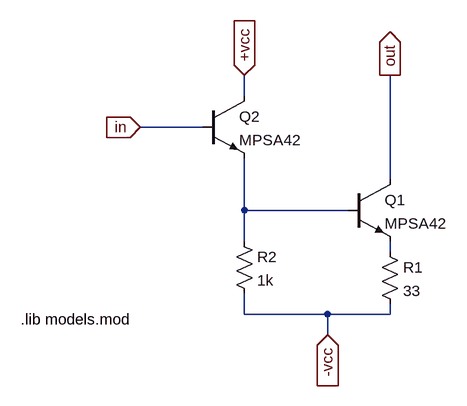
[diagram p0: schematic ss-vas-npn.asc]
ss-vas-npn.asc, the LTspice schematic file:
Version 4
SHEET 1 880 680
WIRE -272 -400 -272 -432
WIRE -336 -352 -432 -352
WIRE -48 -272 -48 -432
WIRE -272 -224 -272 -304
WIRE -112 -224 -272 -224
WIRE -272 -176 -272 -224
WIRE -48 -160 -48 -176
WIRE -272 -64 -272 -96
WIRE -144 -64 -272 -64
WIRE -48 -64 -48 -80
WIRE -48 -64 -144 -64
WIRE -144 -32 -144 -64
FLAG -432 -352 in
IOPIN -432 -352 In
FLAG -144 -32 -vcc
IOPIN -144 -32 In
FLAG -272 -432 +vcc
IOPIN -272 -432 In
FLAG -48 -432 out
IOPIN -48 -432 Out
DATAFLAG -272 -224 "round($*100)/100"
SYMBOL npn -112 -272 R0
SYMATTR InstName Q1
SYMATTR Value MPSA42
SYMBOL res -64 -176 R0
SYMATTR InstName R1
SYMATTR Value 33
SYMBOL npn -336 -400 R0
SYMATTR InstName Q2
SYMATTR Value MPSA42
SYMBOL res -288 -192 R0
SYMATTR InstName R2
SYMATTR Value 1k
TEXT -616 -56 Left 2 !.lib models.mod

The netlist it stands for:
* ss-vas-npn.asc
Q1 out N001 N002 0 MPSA42
R1 N002 -vcc 33
Q2 +vcc in N001 0 MPSA42
R2 N001 -vcc 1k
.model NPN NPN
.model PNP PNP
.lib standard.bjt
.lib models.mod
.backanno
.end